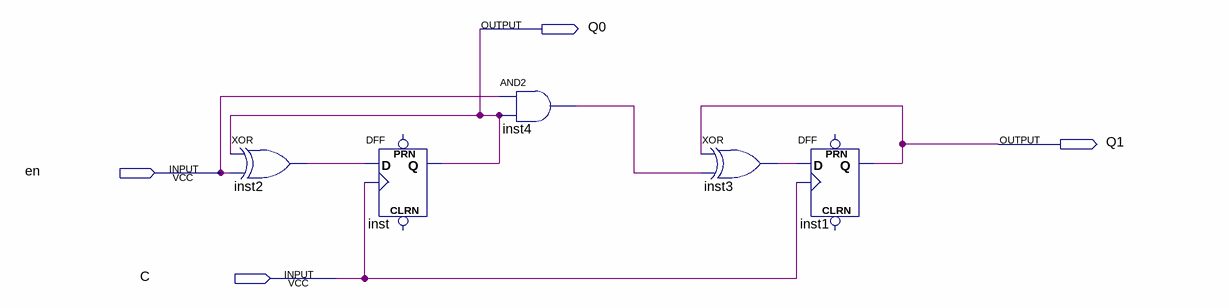
[diagram p0: schematic sheet]
// Quartus schematic Sync_counter_v2.bdf as structural Verilog: 5 symbols, 4 pins
module Sync_counter_v2 (
  input  en,
  input  C,
  output Q0,
  output Q1
);

  wire inst2_out, inst3_out, inst4_out;

  xor inst2 (inst2_out, Q0, en);
  DFF inst (.CLK(C), .D(inst2_out), .Q(Q0));  // open: CLRN, PRN
  and inst4 (inst4_out, en, Q0);
  xor inst3 (inst3_out, Q1, inst4_out);
  DFF inst1 (.CLK(C), .D(inst3_out), .Q(Q1));  // open: CLRN, PRN
endmodule
